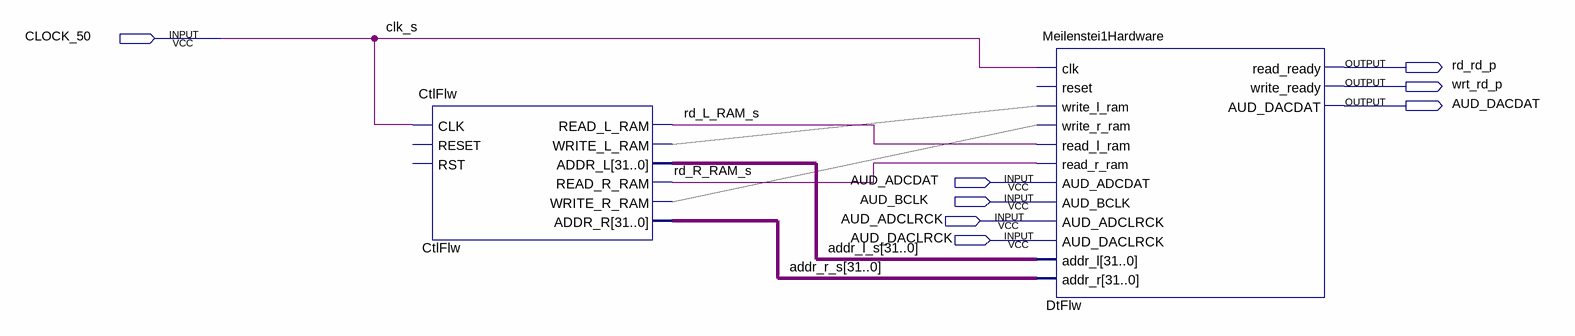
[diagram p0: schematic sheet]
// Quartus schematic TopLvlEnt.bdf as structural Verilog: 2 symbols, 8 pins
module TopLvlEnt (
  input  CLOCK_50,
  input  AUD_ADCDAT,
  input  AUD_BCLK,
  input  AUD_ADCLRCK,
  input  AUD_DACLRCK,
  output rd_rd_p,
  output wrt_rd_p,
  output AUD_DACDAT
);

  wire rd_L_RAM_s, rd_R_RAM_s;
  wire [31:0] addr_l_s, addr_r_s;

  CtlFlw CtlFlw (
    .CLK(CLOCK_50), .READ_L_RAM(rd_L_RAM_s), .ADDR_L(addr_l_s), .READ_R_RAM(rd_R_RAM_s), .ADDR_R(addr_r_s));  // open: RESET, RST, WRITE_L_RAM, WRITE_R_RAM
  Meilenstei1Hardware DtFlw (
    .clk(CLOCK_50), .read_l_ram(rd_L_RAM_s), .read_r_ram(rd_R_RAM_s), .addr_l(addr_l_s), .addr_r(addr_r_s),
    .read_ready(rd_rd_p), .write_ready(wrt_rd_p), .AUD_DACDAT(AUD_DACDAT));  // open: reset, write_l_ram, write_r_ram, AUD_ADCDAT, AUD_BCLK, AUD_ADCLRCK, AUD_DACLRCK

  // Other names for the same wires on the sheet: clk_s = CLOCK_50
endmodule
